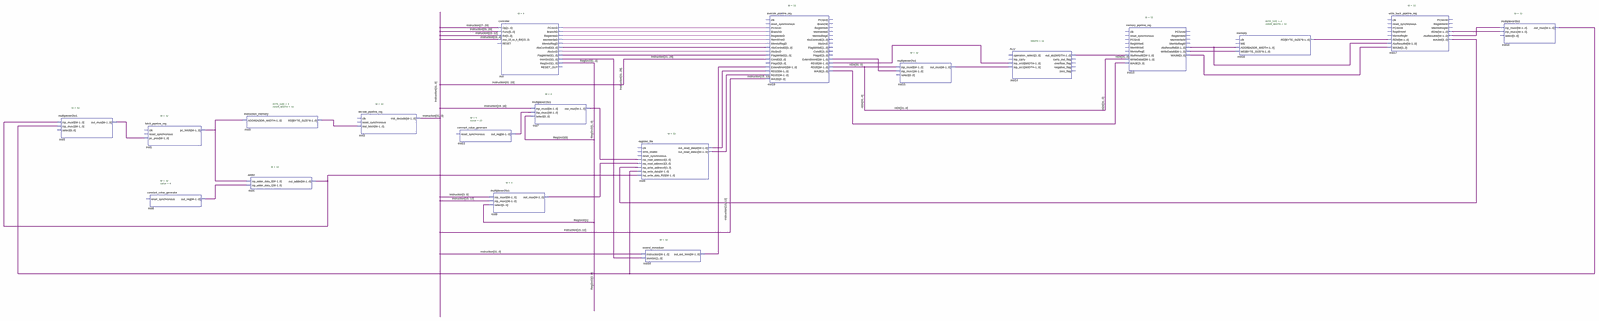
[diagram p0: schematic sheet, whole]
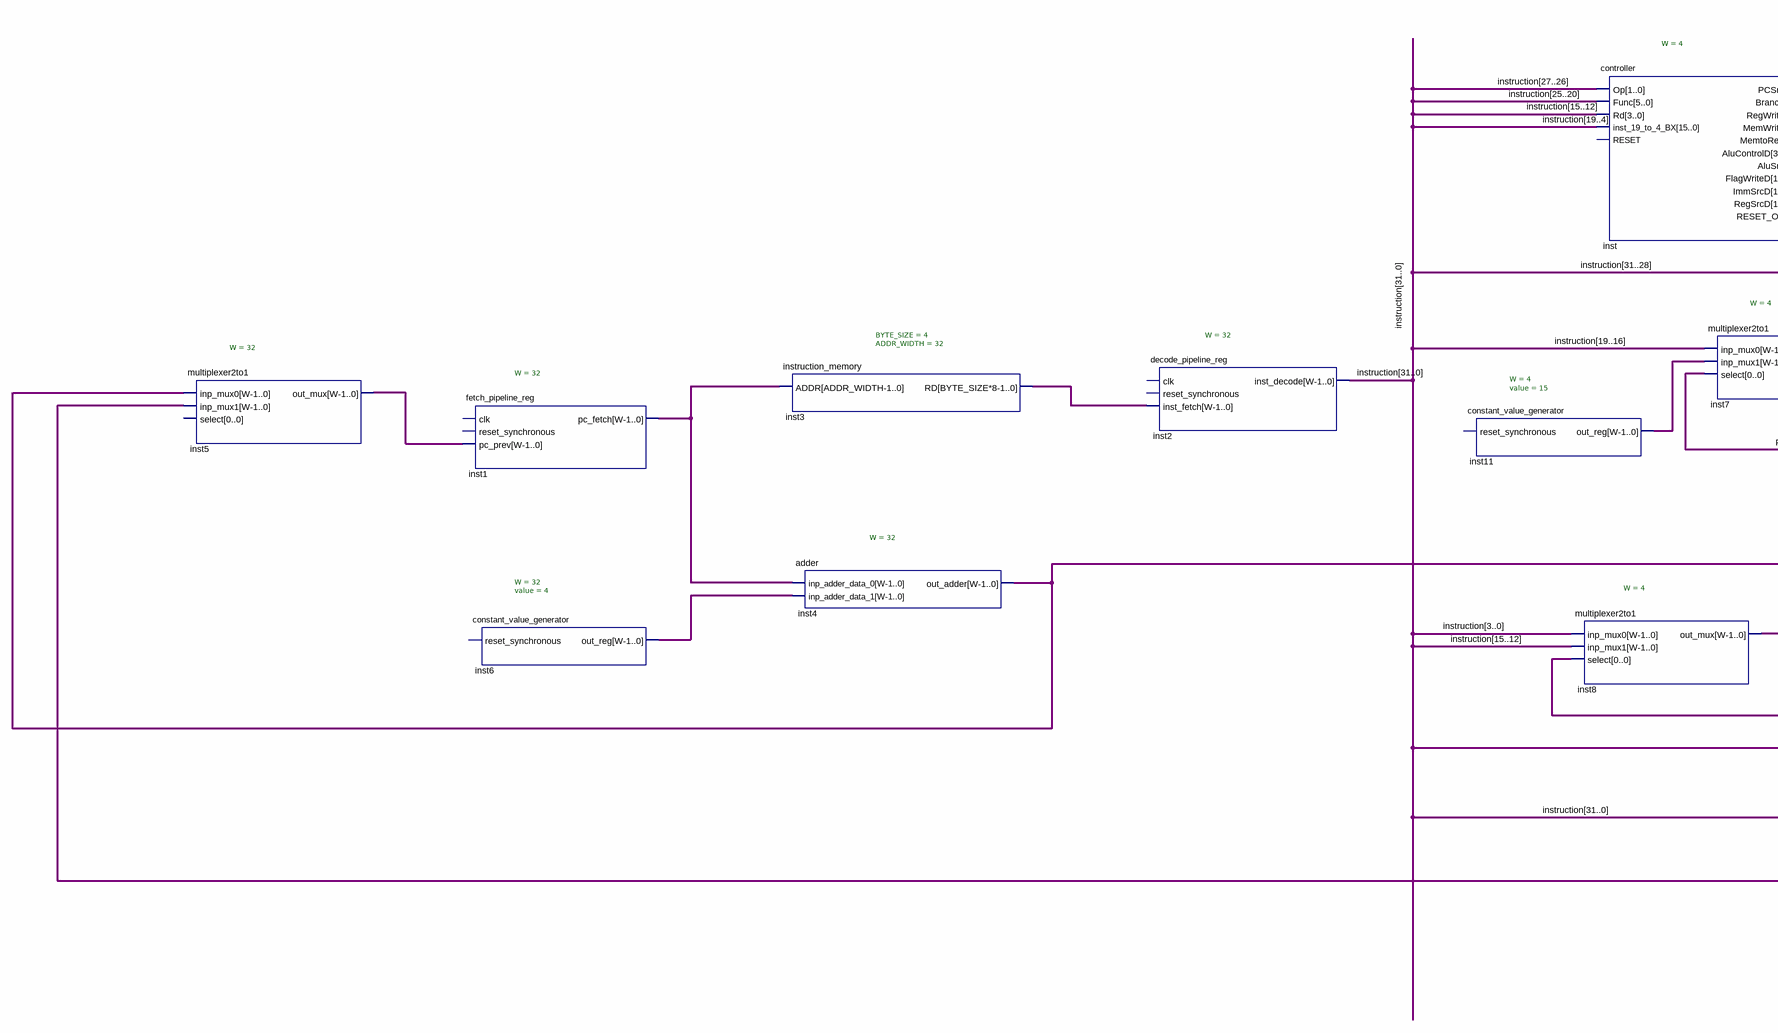
[diagram p1: schematic sheet, left part]
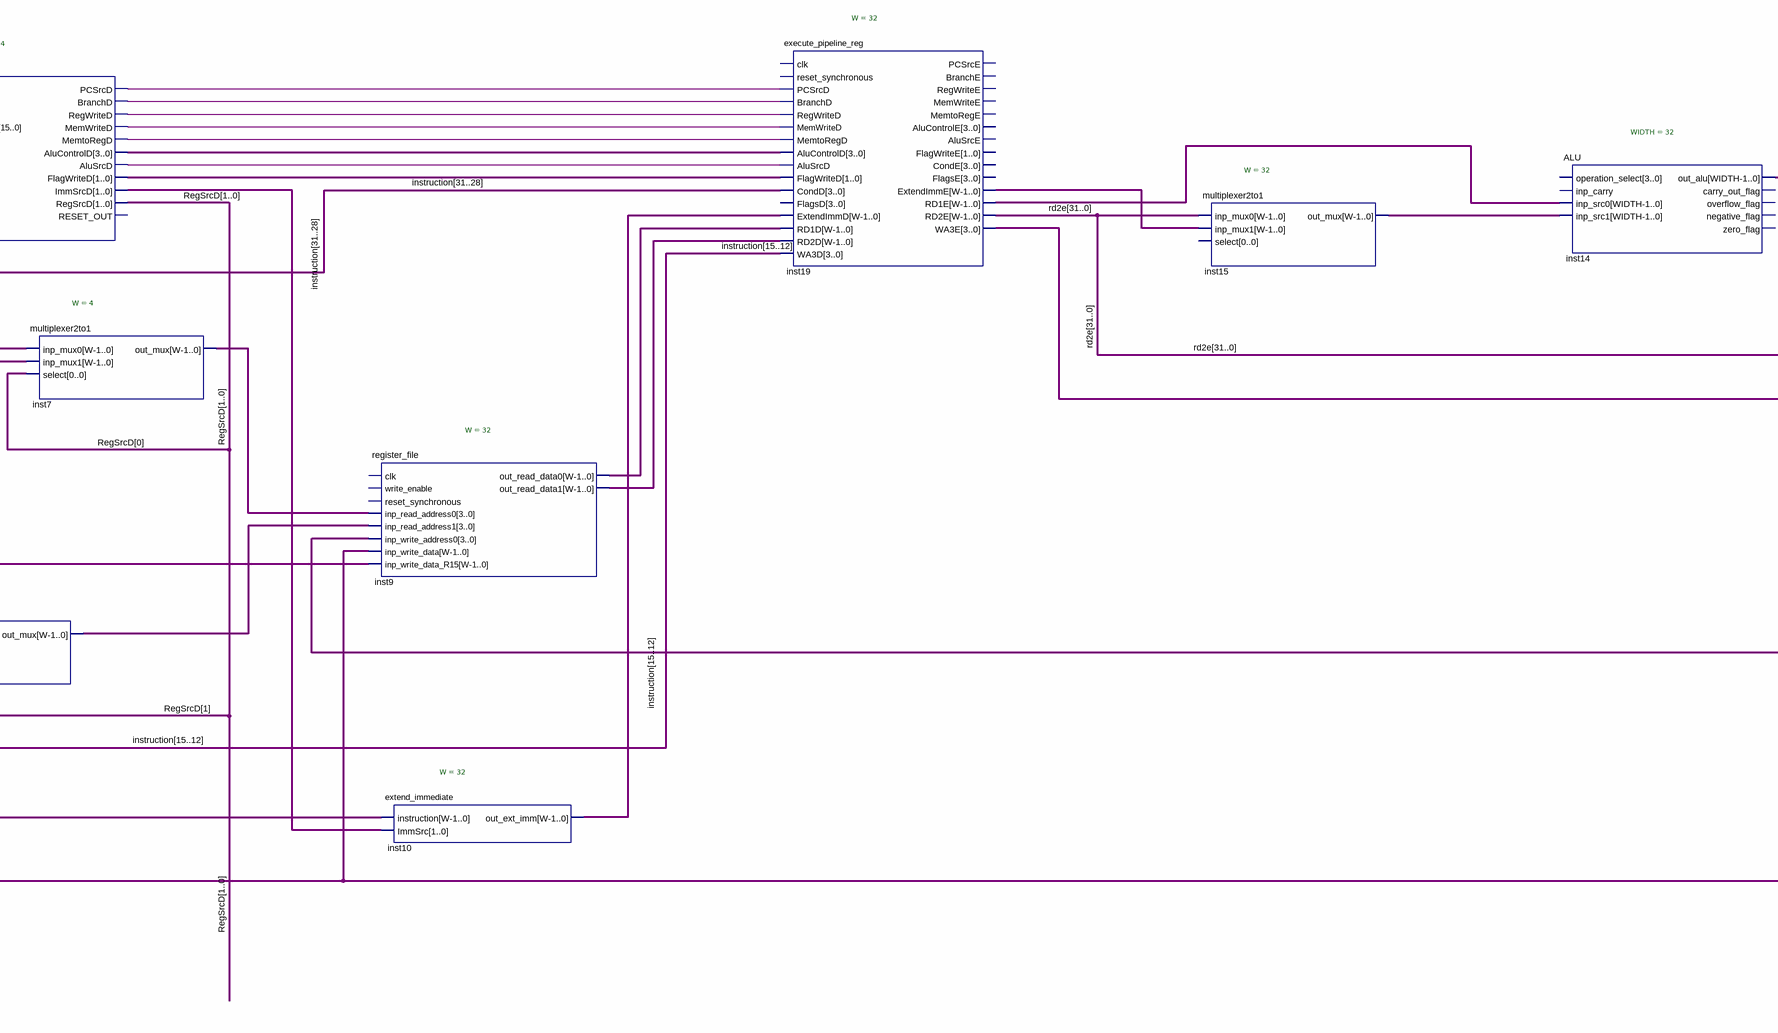
[diagram p2: schematic sheet, centre part]
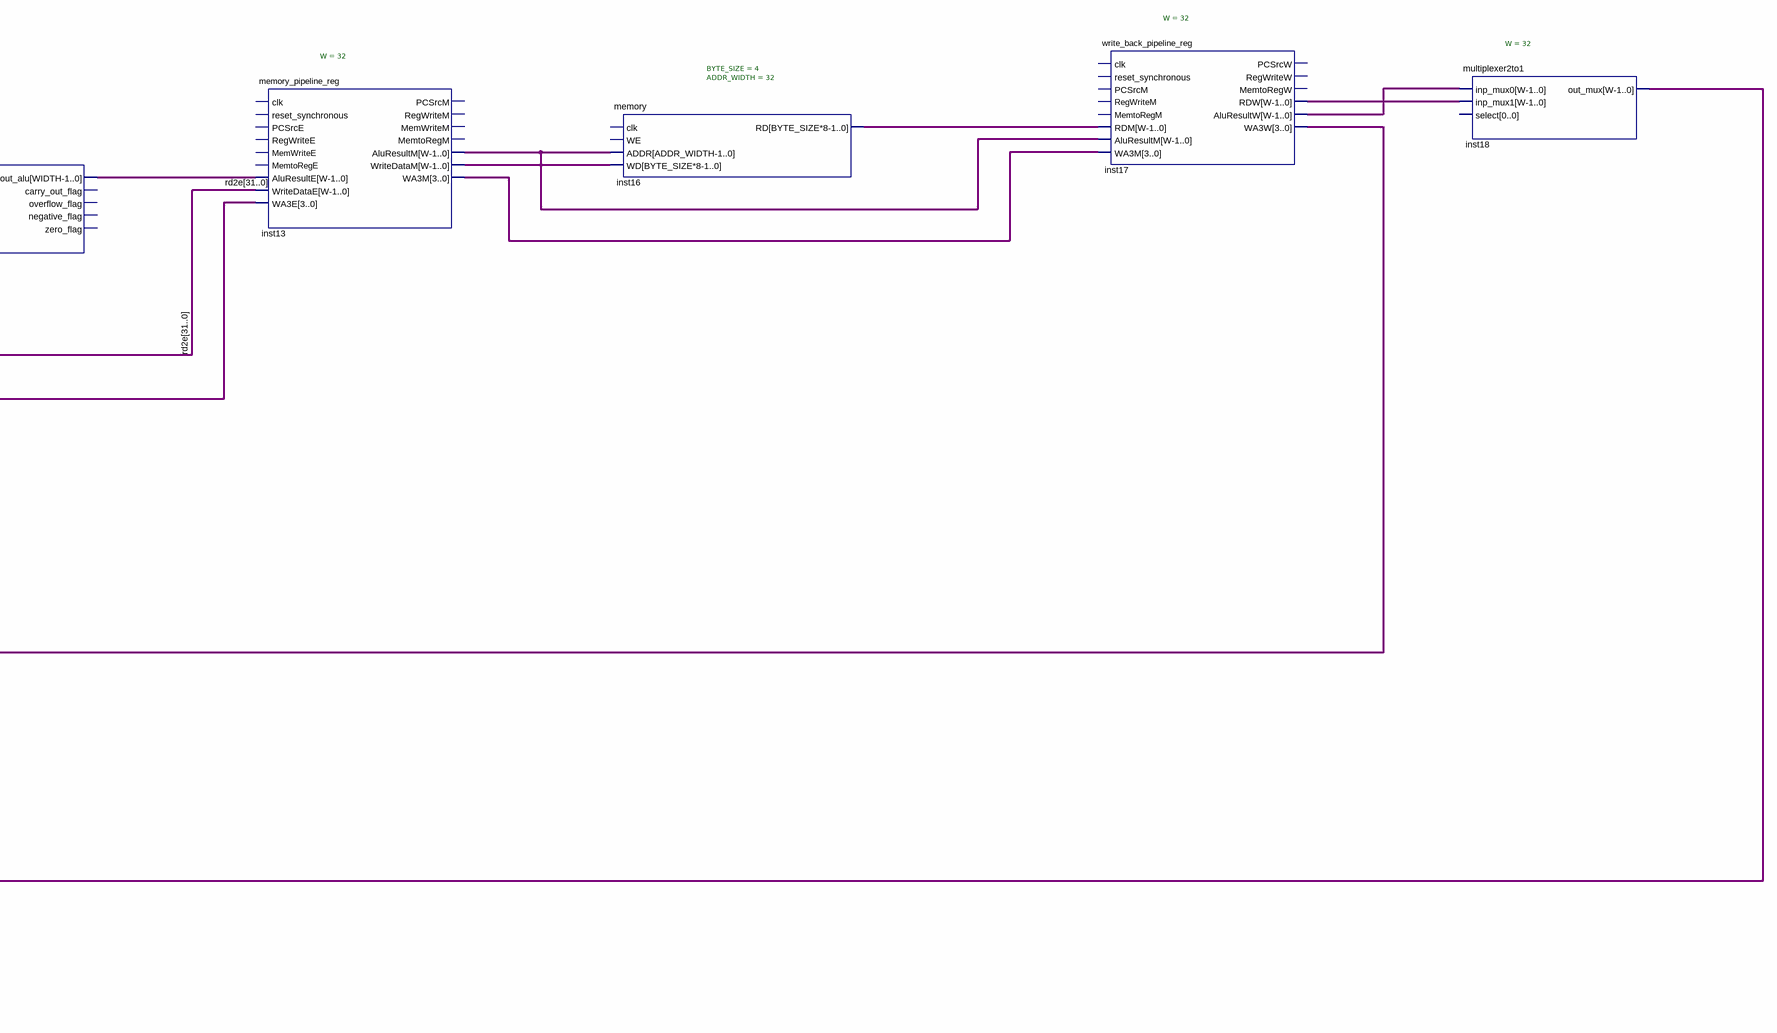
[diagram p3: schematic sheet, right part]
// Quartus schematic Pipelined_Processor_Schema.bdf as structural Verilog: 19 symbols, 0 pins
module Pipelined_Processor_Schema (
);

  wire inst_alusrcd, inst_branchd, inst_memtoregd, inst_memwrited, inst_pcsrcd, inst_regwrited;
  wire [1:0] inst_flagwrited, inst_immsrcd, RegSrcD;
  wire [3:0] inst7_out_mux, inst8_out_mux, inst11_out_reg, inst13_wa3m, inst17_wa3w, inst19_wa3e,
       inst_alucontrold;
  wire [31:0] inst1_pc_fetch, inst3_rd, inst4_out_adder, inst5_out_mux, inst6_out_reg, inst9_out_read_data0,
       inst9_out_read_data1, inst10_out_ext_imm, inst13_aluresultm, inst13_writedatam, inst14_out_alu,
       inst15_out_mux, inst16_rd, inst17_aluresultw, inst17_rdw, inst18_out_mux, inst19_extendimme,
       inst19_rd1e, instruction, rd2e;

  multiplexer2to1 #(.W(32)) inst5 (
    .inp_mux0(inst4_out_adder), .inp_mux1(inst18_out_mux), .out_mux(inst5_out_mux));  // open: select
  fetch_pipeline_reg #(.W(32)) inst1 (
    .pc_prev(inst5_out_mux), .pc_fetch(inst1_pc_fetch));  // open: clk, reset_synchronous
  constant_value_generator #(.W(32), .value(4)) inst6 (.out_reg(inst6_out_reg));  // open: reset_synchronous
  instruction_memory #(.BYTE_SIZE(4), .ADDR_WIDTH(32)) inst3 (.ADDR(inst1_pc_fetch), .RD(inst3_rd));
  adder #(.W(32)) inst4 (
    .inp_adder_data_0(inst1_pc_fetch), .inp_adder_data_1(inst6_out_reg), .out_adder(inst4_out_adder));
  decode_pipeline_reg #(.W(32)) inst2 (
    .inst_fetch(inst3_rd), .inst_decode(instruction));  // open: clk, reset_synchronous
  constant_value_generator #(.W(4), .value(15)) inst11 (.out_reg(inst11_out_reg));  // open: reset_synchronous
  controller #(.W(4)) inst (
    .Op(instruction[27:26]), .Func(instruction[25:20]), .Rd(instruction[15:12]),
    .inst_19_to_4_BX(instruction[19:4]), .PCSrcD(inst_pcsrcd), .BranchD(inst_branchd),
    .RegWriteD(inst_regwrited), .MemWriteD(inst_memwrited), .MemtoRegD(inst_memtoregd),
    .AluControlD(inst_alucontrold), .AluSrcD(inst_alusrcd), .FlagWriteD(inst_flagwrited),
    .ImmSrcD(inst_immsrcd), .RegSrcD(RegSrcD));  // open: RESET, RESET_OUT
  multiplexer2to1 #(.W(4)) inst8 (
    .inp_mux0(instruction[3:0]), .inp_mux1(instruction[15:12]), .select(RegSrcD[1]), .out_mux(inst8_out_mux));
  multiplexer2to1 #(.W(4)) inst7 (
    .inp_mux0(instruction[19:16]), .inp_mux1(inst11_out_reg), .select(RegSrcD[0]), .out_mux(inst7_out_mux));
  register_file #(.W(32)) inst9 (
    .inp_read_address0(inst7_out_mux), .inp_read_address1(inst8_out_mux), .inp_write_address0(inst17_wa3w),
    .inp_write_data(inst18_out_mux), .inp_write_data_R15(inst4_out_adder),
    .out_read_data0(inst9_out_read_data0), .out_read_data1(inst9_out_read_data1));  // open: clk, write_enable, reset_synchronous
  extend_immediate #(.W(32)) inst10 (
    .instruction(instruction), .ImmSrc(inst_immsrcd), .out_ext_imm(inst10_out_ext_imm));
  execute_pipeline_reg #(.W(32)) inst19 (
    .PCSrcD(inst_pcsrcd), .BranchD(inst_branchd), .RegWriteD(inst_regwrited), .MemWriteD(inst_memwrited),
    .MemtoRegD(inst_memtoregd), .AluControlD(inst_alucontrold), .AluSrcD(inst_alusrcd),
    .FlagWriteD(inst_flagwrited), .CondD(instruction[31:28]), .ExtendImmD(inst10_out_ext_imm),
    .RD1D(inst9_out_read_data0), .RD2D(inst9_out_read_data1), .WA3D(instruction[15:12]),
    .ExtendImmE(inst19_extendimme), .RD1E(inst19_rd1e), .RD2E(rd2e), .WA3E(inst19_wa3e));  // open: clk, reset_synchronous, FlagsD, PCSrcE, BranchE, RegWriteE, MemWriteE, MemtoRegE, AluControlE, AluSrcE, FlagWriteE, CondE, FlagsE
  multiplexer2to1 #(.W(32)) inst15 (
    .inp_mux0(rd2e), .inp_mux1(inst19_extendimme), .out_mux(inst15_out_mux));  // open: select
  ALU #(.WIDTH(32)) inst14 (
    .inp_src0(inst19_rd1e), .inp_src1(inst15_out_mux), .out_alu(inst14_out_alu));  // open: operation_select, inp_carry, carry_out_flag, overflow_flag, negative_flag, zero_flag
  memory_pipeline_reg #(.W(32)) inst13 (
    .AluResultE(inst14_out_alu), .WriteDataE(rd2e), .WA3E(inst19_wa3e), .AluResultM(inst13_aluresultm),
    .WriteDataM(inst13_writedatam), .WA3M(inst13_wa3m));  // open: clk, reset_synchronous, PCSrcE, RegWriteE, MemWriteE, MemtoRegE, PCSrcM, RegWriteM, MemWriteM, MemtoRegM
  memory #(.BYTE_SIZE(4), .ADDR_WIDTH(32)) inst16 (
    .ADDR(inst13_aluresultm), .WD(inst13_writedatam), .RD(inst16_rd));  // open: clk, WE
  write_back_pipeline_reg #(.W(32)) inst17 (
    .RDM(inst16_rd), .AluResultM(inst13_aluresultm), .WA3M(inst13_wa3m), .RDW(inst17_rdw),
    .AluResultW(inst17_aluresultw), .WA3W(inst17_wa3w));  // open: clk, reset_synchronous, PCSrcM, RegWriteM, MemtoRegM, PCSrcW, RegWriteW, MemtoRegW
  multiplexer2to1 #(.W(32)) inst18 (
    .inp_mux0(inst17_aluresultw), .inp_mux1(inst17_rdw), .out_mux(inst18_out_mux));  // open: select
endmodule
